# Altium schematic sheet KX1_DB.SchDoc
size 381 x 279 mm; PageSetup: Record=PageOptions|CenterHorizontal=True|CenterVertical=True|PrintScale=1.06|XCorrection=1.00|YCorrection=1.00|PrintKind=2|BorderSize=5000000|LeftOffset=0|BottomOffset=0|Orientation=2|PaperLength=1000|PaperWidth=1000|Scale=100|PaperSource=15|PrintQuality=600|MediaType=1|DitherType=10|PrintScaleMode=1|PaperKind=Letter
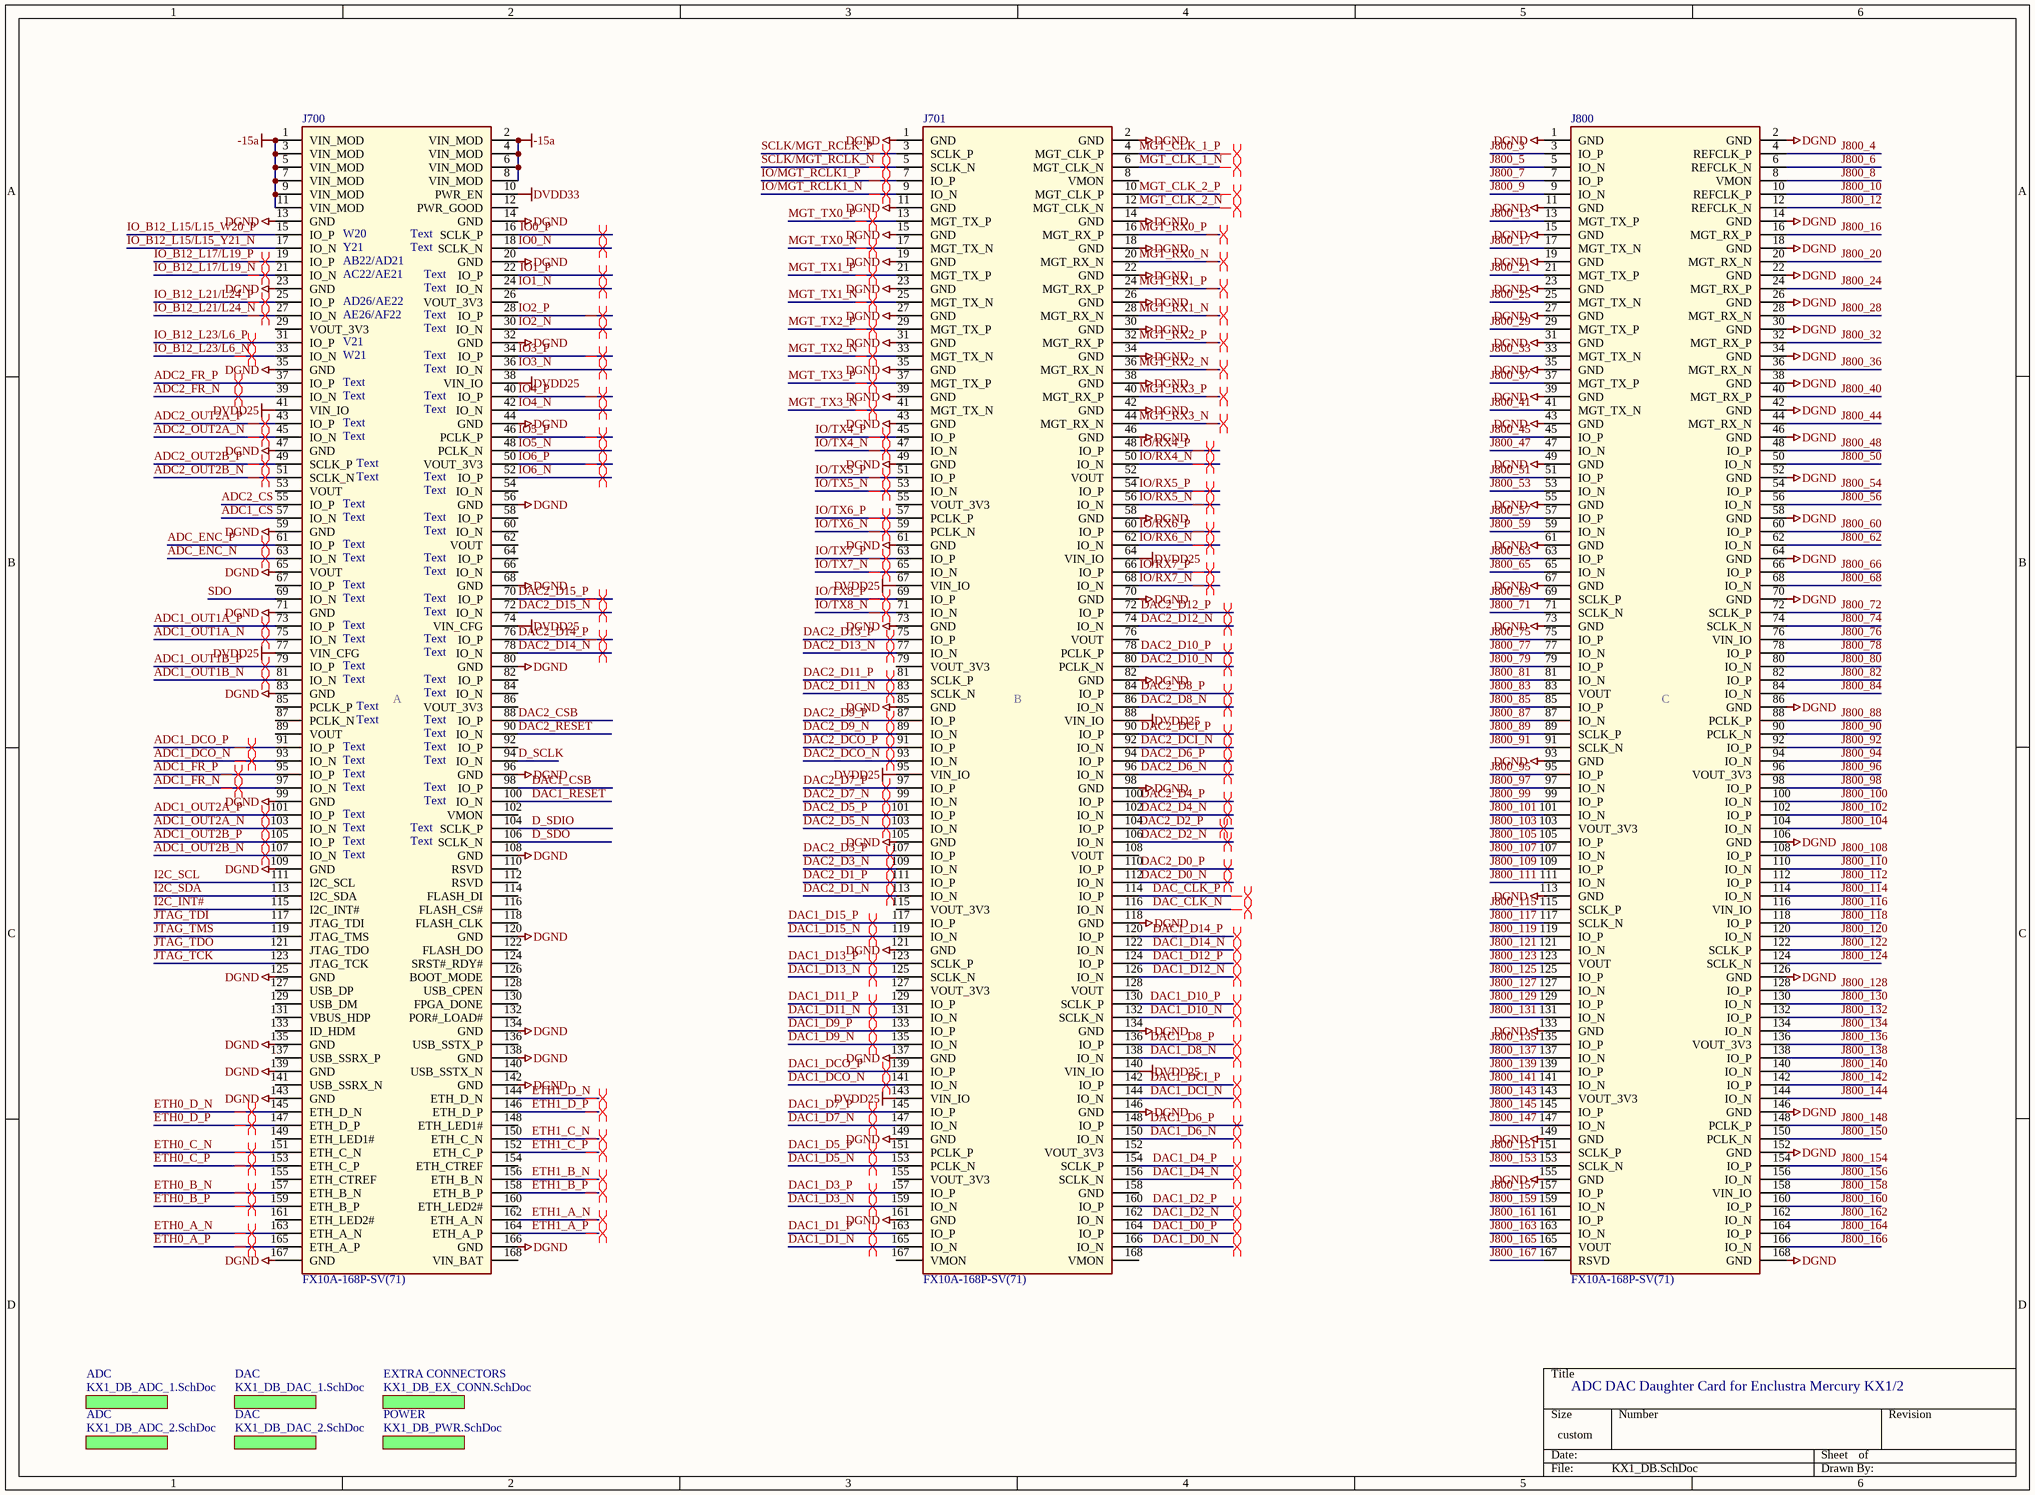
[diagram p0: KX1_DB.SchDoc]

## Parts
J700  FX10A-168P-SV(71)  [Mercury_Baseboard_Connector]
J701  FX10A-168P-SV(71)  [Mercury_Baseboard_Connector]
J800  FX10A-168P-SV(71)  [Mercury_Baseboard_Connector]

## Sub-sheets
ADC = KX1_DB_ADC_1.SchDoc: no entries
ADC = KX1_DB_ADC_2.SchDoc: no entries
DAC = KX1_DB_DAC_2.SchDoc: no entries
DAC = KX1_DB_DAC_1.SchDoc: no entries
EXTRA CONNECTORS = KX1_DB_EX_CONN.SchDoc: no entries
POWER = KX1_DB_PWR.SchDoc: no entries

## Nets
-15a: J700.1(VIN_MOD) J700.2(VIN_MOD) J700.3(VIN_MOD) J700.4(VIN_MOD) J700.5(VIN_MOD) J700.6(VIN_MOD) J700.7(VIN_MOD) J700.8(VIN_MOD) J700.9(VIN_MOD) J700.11(VIN_MOD)
DGND: J700.13(GND) J700.14(GND) J700.20(GND) J700.23(GND) J700.32(GND) J700.35(GND) J700.44(GND) J700.47(GND) J700.56(GND) J700.59(GND) J700.65(VOUT) J700.68(GND) J700.71(GND) J700.80(GND) J700.83(GND) J700.96(GND) J700.99(GND) J700.108(GND) J700.109(GND) J700.120(GND) J700.125(GND) J700.134(GND) J700.135(GND) J700.138(GND) J700.139(GND) J700.142(GND) J700.143(GND) J700.166(GND) J700.167(GND) J701.1(GND) J701.2(GND) J701.11(GND) J701.14(GND) J701.15(GND) J701.18(GND) J701.19(GND) J701.22(GND) J701.23(GND) J701.26(GND) J701.27(GND) J701.30(GND) J701.31(GND) J701.34(GND) J701.35(GND) J701.38(GND) J701.39(GND) J701.42(GND) J701.43(GND) J701.46(GND) J701.49(GND) J701.58(GND) J701.61(GND) J701.70(GND) J701.73(GND) J701.82(GND) J701.85(GND) J701.98(GND) J701.105(GND) J701.118(GND) J701.121(GND) J701.134(GND) J701.137(GND) J701.146(GND) J701.149(GND) J701.161(GND) J800.1(GND) J800.2(GND) J800.11(GND) J800.14(GND) J800.15(GND) J800.18(GND) J800.19(GND) J800.22(GND) J800.23(GND) J800.26(GND) J800.27(GND) J800.30(GND) J800.31(GND) J800.34(GND) J800.35(GND) J800.38(GND) J800.39(GND) J800.42(GND) J800.43(GND) J800.46(GND) J800.49(GND) J800.52(GND) J800.55(GND) J800.58(GND) J800.61(GND) J800.64(GND) J800.67(GND) J800.70(GND) J800.73(GND) J800.86(GND) J800.93(GND) J800.106(GND) J800.113(GND) J800.126(GND) J800.133(GND) J800.146(GND) J800.149(GND) J800.152(GND) J800.155(GND) J800.168(GND)
DVDD25: J700.38(VIN_IO) J700.41(VIN_IO) J700.74(VIN_CFG) J700.77(VIN_CFG) J701.64(VIN_IO) J701.67(VIN_IO) J701.88(VIN_IO) J701.95(VIN_IO) J701.140(VIN_IO) J701.143(VIN_IO)
DVDD33: J700.10(PWR_EN)
ADC1_CS: J700.57(IO_N)
ADC1_DCO_N: J700.93(IO_N)
ADC1_DCO_P: J700.91(IO_P)
ADC1_FR_N: J700.97(IO_N)
ADC1_FR_P: J700.95(IO_P)
ADC1_OUT1A_N: J700.75(IO_N)
ADC1_OUT1A_P: J700.73(IO_P)
ADC1_OUT1B_N: J700.81(IO_N)
ADC1_OUT1B_P: J700.79(IO_P)
ADC1_OUT2A_N: J700.103(IO_N)
ADC1_OUT2A_P: J700.101(IO_P)
ADC1_OUT2B_N: J700.107(IO_N)
ADC1_OUT2B_P: J700.105(IO_P)
ADC2_CS: J700.55(IO_P)
ADC2_FR_N: J700.39(IO_N)
ADC2_FR_P: J700.37(IO_P)
ADC2_OUT2A_N: J700.45(IO_N)
ADC2_OUT2A_P: J700.43(IO_P)
ADC2_OUT2B_N: J700.51(SCLK_N)
ADC2_OUT2B_P: J700.49(SCLK_P)
ADC_ENC_N: J700.63(IO_N)
ADC_ENC_P: J700.61(IO_P)
D_SCLK: J700.94(IO_N)
D_SDIO: J700.104(SCLK_P)
D_SDO: J700.106(SCLK_N)
DAC1_CSB: J700.98(IO_P)
DAC1_D0_N: J701.166(IO_N)
DAC1_D0_P: J701.164(IO_P)
DAC1_D1_N: J701.165(IO_N)
DAC1_D1_P: J701.163(IO_P)
DAC1_D2_N: J701.162(IO_N)
DAC1_D2_P: J701.160(IO_P)
DAC1_D3_N: J701.159(IO_N)
DAC1_D3_P: J701.157(IO_P)
DAC1_D4_N: J701.156(SCLK_N)
DAC1_D4_P: J701.154(SCLK_P)
DAC1_D5_N: J701.153(PCLK_N)
DAC1_D5_P: J701.151(PCLK_P)
DAC1_D6_N: J701.150(IO_N)
DAC1_D6_P: J701.148(IO_P)
DAC1_D7_N: J701.147(IO_N)
DAC1_D7_P: J701.145(IO_P)
DAC1_D8_N: J701.138(IO_N)
DAC1_D8_P: J701.136(IO_P)
DAC1_D9_N: J701.135(IO_N)
DAC1_D9_P: J701.133(IO_P)
DAC1_D10_N: J701.132(SCLK_N)
DAC1_D10_P: J701.130(SCLK_P)
DAC1_D11_N: J701.131(IO_N)
DAC1_D11_P: J701.129(IO_P)
DAC1_D12_N: J701.126(IO_N)
DAC1_D12_P: J701.124(IO_P)
DAC1_D13_N: J701.125(SCLK_N)
DAC1_D13_P: J701.123(SCLK_P)
DAC1_D14_N: J701.122(IO_N)
DAC1_D14_P: J701.120(IO_P)
DAC1_D15_N: J701.119(IO_N)
DAC1_D15_P: J701.117(IO_P)
DAC1_DCI_N: J701.144(IO_N)
DAC1_DCI_P: J701.142(IO_P)
DAC1_DCO_N: J701.141(IO_N)
DAC1_DCO_P: J701.139(IO_P)
DAC1_RESET: J700.100(IO_N)
DAC2_CSB: J700.88(IO_P)
DAC2_D0_N: J701.112(IO_N)
DAC2_D0_P: J701.110(IO_P)
DAC2_D1_N: J701.113(IO_N)
DAC2_D1_P: J701.111(IO_P)
DAC2_D2_N: J701.106(IO_N)
DAC2_D2_P: J701.104(IO_P)
DAC2_D3_N: J701.109(IO_N)
DAC2_D3_P: J701.107(IO_P)
DAC2_D4_N: J701.102(IO_N)
DAC2_D4_P: J701.100(IO_P)
DAC2_D5_N: J701.103(IO_N)
DAC2_D5_P: J701.101(IO_P)
DAC2_D6_N: J701.96(IO_N)
DAC2_D6_P: J701.94(IO_P)
DAC2_D7_N: J701.99(IO_N)
DAC2_D7_P: J701.97(IO_P)
DAC2_D8_N: J701.86(IO_N)
DAC2_D8_P: J701.84(IO_P)
DAC2_D9_N: J701.89(IO_N)
DAC2_D9_P: J701.87(IO_P)
DAC2_D10_N: J701.80(PCLK_N)
DAC2_D10_P: J701.78(PCLK_P)
DAC2_D11_N: J701.83(SCLK_N)
DAC2_D11_P: J701.81(SCLK_P)
DAC2_D12_N: J701.74(IO_N)
DAC2_D12_P: J701.72(IO_P)
DAC2_D13_N: J701.77(IO_N)
DAC2_D13_P: J701.75(IO_P)
DAC2_D14_N: J700.78(IO_N)
DAC2_D14_P: J700.76(IO_P)
DAC2_D15_N: J700.72(IO_N)
DAC2_D15_P: J700.70(IO_P)
DAC2_DCI_N: J701.92(IO_N)
DAC2_DCI_P: J701.90(IO_P)
DAC2_DCO_N: J701.93(IO_N)
DAC2_DCO_P: J701.91(IO_P)
DAC2_RESET: J700.90(IO_N)
DAC_CLK_N: J701.116(IO_N)
DAC_CLK_P: J701.114(IO_P)
ETH0_A_N: J700.163(ETH_A_N)
ETH0_A_P: J700.165(ETH_A_P)
ETH0_B_N: J700.157(ETH_B_N)
ETH0_B_P: J700.159(ETH_B_P)
ETH0_C_N: J700.151(ETH_C_N)
ETH0_C_P: J700.153(ETH_C_P)
ETH0_D_N: J700.145(ETH_D_N)
ETH0_D_P: J700.147(ETH_D_P)
ETH1_A_N: J700.162(ETH_A_N)
ETH1_A_P: J700.164(ETH_A_P)
ETH1_B_N: J700.156(ETH_B_N)
ETH1_B_P: J700.158(ETH_B_P)
ETH1_C_N: J700.150(ETH_C_N)
ETH1_C_P: J700.152(ETH_C_P)
ETH1_D_N: J700.144(ETH_D_N)
ETH1_D_P: J700.146(ETH_D_P)
I2C_INT#: J700.115(I2C_INT#)
I2C_SCL: J700.111(I2C_SCL)
I2C_SDA: J700.113(I2C_SDA)
IO0_N: J700.18(SCLK_N)
IO0_P: J700.16(SCLK_P)
IO1_N: J700.24(IO_N)
IO1_P: J700.22(IO_P)
IO2_N: J700.30(IO_N)
IO2_P: J700.28(IO_P)
IO3_N: J700.36(IO_N)
IO3_P: J700.34(IO_P)
IO4_N: J700.42(IO_N)
IO4_P: J700.40(IO_P)
IO5_N: J700.48(PCLK_N)
IO5_P: J700.46(PCLK_P)
IO6_N: J700.52(IO_P)
IO6_P: J700.50(VOUT_3V3)
IO/MGT_RCLK1_N: J701.9(IO_N)
IO/MGT_RCLK1_P: J701.7(IO_P)
IO/RX4_N: J701.50(IO_N)
IO/RX4_P: J701.48(IO_P)
IO/RX5_N: J701.56(IO_N)
IO/RX5_P: J701.54(IO_P)
IO/RX6_N: J701.62(IO_N)
IO/RX6_P: J701.60(IO_P)
IO/RX7_N: J701.68(IO_N)
IO/RX7_P: J701.66(IO_P)
IO/TX4_N: J701.47(IO_N)
IO/TX4_P: J701.45(IO_P)
IO/TX5_N: J701.53(IO_N)
IO/TX5_P: J701.51(IO_P)
IO/TX6_N: J701.59(PCLK_N)
IO/TX6_P: J701.57(PCLK_P)
IO/TX7_N: J701.65(IO_N)
IO/TX7_P: J701.63(IO_P)
IO/TX8_N: J701.71(IO_N)
IO/TX8_P: J701.69(IO_P)
IO_B12_L15/L15_W20_P: J700.15(IO_P)
IO_B12_L15/L15_Y21_N: J700.17(IO_N)
IO_B12_L17/L19_N: J700.21(IO_N)
IO_B12_L17/L19_P: J700.19(IO_P)
IO_B12_L21/L24_N: J700.27(IO_N)
IO_B12_L21/L24_P: J700.25(IO_P)
IO_B12_L23/L6_N: J700.33(IO_N)
IO_B12_L23/L6_P: J700.31(IO_P)
J800_3: J800.3(IO_P)
J800_4: J800.4(REFCLK_P)
J800_5: J800.5(IO_N)
J800_6: J800.6(REFCLK_N)
J800_7: J800.7(IO_P)
J800_8: J800.8(VMON)
J800_9: J800.9(IO_N)
J800_10: J800.10(REFCLK_P)
J800_12: J800.12(REFCLK_N)
J800_13: J800.13(MGT_TX_P)
J800_16: J800.16(MGT_RX_P)
J800_17: J800.17(MGT_TX_N)
J800_20: J800.20(MGT_RX_N)
J800_21: J800.21(MGT_TX_P)
J800_24: J800.24(MGT_RX_P)
J800_25: J800.25(MGT_TX_N)
J800_28: J800.28(MGT_RX_N)
J800_29: J800.29(MGT_TX_P)
J800_32: J800.32(MGT_RX_P)
J800_33: J800.33(MGT_TX_N)
J800_36: J800.36(MGT_RX_N)
J800_37: J800.37(MGT_TX_P)
J800_40: J800.40(MGT_RX_P)
J800_41: J800.41(MGT_TX_N)
J800_44: J800.44(MGT_RX_N)
J800_45: J800.45(IO_P)
J800_47: J800.47(IO_N)
J800_48: J800.48(IO_P)
J800_50: J800.50(IO_N)
J800_51: J800.51(IO_P)
J800_53: J800.53(IO_N)
J800_54: J800.54(IO_P)
J800_56: J800.56(IO_N)
J800_57: J800.57(IO_P)
J800_59: J800.59(IO_N)
J800_60: J800.60(IO_P)
J800_62: J800.62(IO_N)
J800_63: J800.63(IO_P)
J800_65: J800.65(IO_N)
J800_66: J800.66(IO_P)
J800_68: J800.68(IO_N)
J800_69: J800.69(SCLK_P)
J800_71: J800.71(SCLK_N)
J800_72: J800.72(SCLK_P)
J800_74: J800.74(SCLK_N)
J800_75: J800.75(IO_P)
J800_76: J800.76(VIN_IO)
J800_77: J800.77(IO_N)
J800_78: J800.78(IO_P)
J800_79: J800.79(IO_P)
J800_80: J800.80(IO_N)
J800_81: J800.81(IO_N)
J800_82: J800.82(IO_P)
J800_83: J800.83(VOUT)
J800_84: J800.84(IO_N)
J800_85: J800.85(IO_P)
J800_87: J800.87(IO_N)
J800_88: J800.88(PCLK_P)
J800_89: J800.89(SCLK_P)
J800_90: J800.90(PCLK_N)
J800_91: J800.91(SCLK_N)
J800_92: J800.92(IO_P)
J800_94: J800.94(IO_N)
J800_95: J800.95(IO_P)
J800_96: J800.96(VOUT_3V3)
J800_97: J800.97(IO_N)
J800_98: J800.98(IO_P)
J800_99: J800.99(IO_P)
J800_100: J800.100(IO_N)
J800_101: J800.101(IO_N)
J800_102: J800.102(IO_P)
J800_103: J800.103(VOUT_3V3)
J800_104: J800.104(IO_N)
J800_105: J800.105(IO_P)
J800_107: J800.107(IO_N)
J800_108: J800.108(IO_P)
J800_109: J800.109(IO_P)
J800_110: J800.110(IO_N)
J800_111: J800.111(IO_N)
J800_112: J800.112(IO_P)
J800_114: J800.114(IO_N)
J800_115: J800.115(SCLK_P)
J800_116: J800.116(VIN_IO)
J800_117: J800.117(SCLK_N)
J800_118: J800.118(IO_P)
J800_119: J800.119(IO_P)
J800_120: J800.120(IO_N)
J800_121: J800.121(IO_N)
J800_122: J800.122(SCLK_P)
J800_123: J800.123(VOUT)
J800_124: J800.124(SCLK_N)
J800_125: J800.125(IO_P)
J800_127: J800.127(IO_N)
J800_128: J800.128(IO_P)
J800_129: J800.129(IO_P)
J800_130: J800.130(IO_N)
J800_131: J800.131(IO_N)
J800_132: J800.132(IO_P)
J800_134: J800.134(IO_N)
J800_135: J800.135(IO_P)
J800_136: J800.136(VOUT_3V3)
J800_137: J800.137(IO_N)
J800_138: J800.138(IO_P)
J800_139: J800.139(IO_P)
J800_140: J800.140(IO_N)
J800_141: J800.141(IO_N)
J800_142: J800.142(IO_P)
J800_143: J800.143(VOUT_3V3)
J800_144: J800.144(IO_N)
J800_145: J800.145(IO_P)
J800_147: J800.147(IO_N)
J800_148: J800.148(PCLK_P)
J800_150: J800.150(PCLK_N)
J800_151: J800.151(SCLK_P)
J800_153: J800.153(SCLK_N)
J800_154: J800.154(IO_P)
J800_156: J800.156(IO_N)
J800_157: J800.157(IO_P)
J800_158: J800.158(VIN_IO)
J800_159: J800.159(IO_N)
J800_160: J800.160(IO_P)
J800_161: J800.161(IO_P)
J800_162: J800.162(IO_N)
J800_163: J800.163(IO_N)
J800_164: J800.164(IO_P)
J800_165: J800.165(VOUT)
J800_166: J800.166(IO_N)
J800_167: J800.167(RSVD)
JTAG_TCK: J700.123(JTAG_TCK)
JTAG_TDI: J700.117(JTAG_TDI)
JTAG_TDO: J700.121(JTAG_TDO)
JTAG_TMS: J700.119(JTAG_TMS)
MGT_CLK_1_N: J701.6(MGT_CLK_N)
MGT_CLK_1_P: J701.4(MGT_CLK_P)
MGT_CLK_2_N: J701.12(MGT_CLK_N)
MGT_CLK_2_P: J701.10(MGT_CLK_P)
MGT_RX0_N: J701.20(MGT_RX_N)
MGT_RX0_P: J701.16(MGT_RX_P)
MGT_RX1_N: J701.28(MGT_RX_N)
MGT_RX1_P: J701.24(MGT_RX_P)
MGT_RX2_N: J701.36(MGT_RX_N)
MGT_RX2_P: J701.32(MGT_RX_P)
MGT_RX3_N: J701.44(MGT_RX_N)
MGT_RX3_P: J701.40(MGT_RX_P)
MGT_TX0_N: J701.17(MGT_TX_N)
MGT_TX0_P: J701.13(MGT_TX_P)
MGT_TX1_N: J701.25(MGT_TX_N)
MGT_TX1_P: J701.21(MGT_TX_P)
MGT_TX2_N: J701.33(MGT_TX_N)
MGT_TX2_P: J701.29(MGT_TX_P)
MGT_TX3_N: J701.41(MGT_TX_N)
MGT_TX3_P: J701.37(MGT_TX_P)
SCLK/MGT_RCLK_N: J701.5(SCLK_N)
SCLK/MGT_RCLK_P: J701.3(SCLK_P)
SDO: J700.69(IO_N)

Not connected (* = marked no-connect by the designer): J700 12(PWR_GOOD) 26(VOUT_3V3) 29(VOUT_3V3) 53(VOUT) 54(IO_N) 58(IO_P) 60(IO_N) 62(VOUT) 64(IO_P) 66(IO_N) 67(IO_P) 82(IO_P) 84(IO_N) 85(PCLK_P) 86(VOUT_3V3) 87(PCLK_N) 89(VOUT) 92(IO_P) 102(VMON) 110(RSVD) 112(RSVD) 114(FLASH_DI) 116(FLASH_CS#) 118(FLASH_CLK) 122(FLASH_DO) 124(SRST#_RDY#) 126(BOOT_MODE) 127(USB_DP) 128(USB_CPEN) 129(USB_DM) 130(FPGA_DONE) 131(VBUS_HDP) 132(POR#_LOAD#) 133(ID_HDM) 136(USB_SSTX_P) 137(USB_SSRX_P) 140(USB_SSTX_N) 141(USB_SSRX_N) 148(ETH_LED1#) 149(ETH_LED1#) 154(ETH_CTREF) 155(ETH_CTREF) 160(ETH_LED2#) 161(ETH_LED2#) 168(VIN_BAT); J701 8(VMON) 52(VOUT) 55(VOUT_3V3) 76(VOUT) 79(VOUT_3V3) 108(VOUT) 115(VOUT_3V3) 127(VOUT_3V3) 128(VOUT) 152(VOUT_3V3) 155(VOUT_3V3) 158(GND) 167(VMON) 168(VMON)

## Layout directives
differential pair: ADC1_DCO_N, ADC1_DCO_P, ADC1_FR_N, ADC1_FR_P, ADC1_OUT1A_N, ADC1_OUT1A_P, ADC1_OUT1B_N, ADC1_OUT1B_P, ADC1_OUT2A_N, ADC1_OUT2A_P, ADC1_OUT2B_N, ADC1_OUT2B_P, ADC2_FR_N, ADC2_FR_P, ADC2_OUT2A_N, ADC2_OUT2A_P, ADC2_OUT2B_N, ADC2_OUT2B_P, ADC_ENC_N, ADC_ENC_P, DAC1_D0_N, DAC1_D0_P, DAC1_D1_N, DAC1_D1_P, DAC1_D2_N, DAC1_D2_P, DAC1_D3_N, DAC1_D3_P, DAC1_D4_N, DAC1_D4_P, DAC1_D5_N, DAC1_D5_P, DAC1_D6_N, DAC1_D6_P, DAC1_D7_N, DAC1_D7_P, DAC1_D8_N, DAC1_D8_P, DAC1_D9_N, DAC1_D9_P, DAC1_D10_N, DAC1_D10_P, DAC1_D11_N, DAC1_D11_P, DAC1_D12_N, DAC1_D12_P, DAC1_D13_N, DAC1_D13_P, DAC1_D14_N, DAC1_D14_P, DAC1_D15_N, DAC1_D15_P, DAC1_DCI_N, DAC1_DCI_P, DAC1_DCO_N, DAC1_DCO_P, DAC2_D0_N, DAC2_D0_P, DAC2_D1_N, DAC2_D1_P, DAC2_D2_N, DAC2_D2_P, DAC2_D3_N, DAC2_D3_P, DAC2_D4_N, DAC2_D4_P, DAC2_D5_N, DAC2_D5_P, DAC2_D6_N, DAC2_D6_P, DAC2_D7_N, DAC2_D7_P, DAC2_D8_N, DAC2_D8_P, DAC2_D9_N, DAC2_D9_P, DAC2_D10_N, DAC2_D10_P, DAC2_D11_N, DAC2_D11_P, DAC2_D12_N, DAC2_D12_P, DAC2_D13_N, DAC2_D13_P, DAC2_D14_N, DAC2_D14_P, DAC2_D15_N, DAC2_D15_P, DAC2_DCI_N, DAC2_DCI_P, DAC2_DCO_N, DAC2_DCO_P, DAC_CLK_N, DAC_CLK_P, ETH0_A_N, ETH0_A_P, ETH0_B_N, ETH0_B_P, ETH0_C_N, ETH0_C_P, ETH0_D_N, ETH0_D_P, ETH1_A_N, ETH1_A_P, ETH1_B_N, ETH1_B_P, ETH1_C_N, ETH1_C_P, ETH1_D_N, ETH1_D_P, IO0_N, IO0_P, IO1_N, IO1_P, IO2_N, IO2_P, IO3_N, IO3_P, IO4_N, IO4_P, IO5_N, IO5_P, IO6_N, IO6_P, IO/MGT_RCLK1_N, IO/MGT_RCLK1_P, IO/RX4_N, IO/RX4_P, IO/RX5_N, IO/RX5_P, IO/RX6_N, IO/RX6_P, IO/RX7_N, IO/RX7_P, IO/TX4_N, IO/TX4_P, IO/TX5_N, IO/TX5_P, IO/TX6_N, IO/TX6_P, IO/TX7_N, IO/TX7_P, IO/TX8_N, IO/TX8_P, IO_B12_L17/L19_N, IO_B12_L17/L19_P, IO_B12_L21/L24_N, IO_B12_L21/L24_P, IO_B12_L23/L6_N, IO_B12_L23/L6_P, MGT_CLK_1_N, MGT_CLK_1_P, MGT_CLK_2_N, MGT_CLK_2_P, MGT_RX0_N, MGT_RX0_P, MGT_RX1_N, MGT_RX1_P, MGT_RX2_N, MGT_RX2_P, MGT_RX3_N, MGT_RX3_P, MGT_TX0_N, MGT_TX0_P, MGT_TX1_N, MGT_TX1_P, MGT_TX2_N, MGT_TX2_P, MGT_TX3_N, MGT_TX3_P, SCLK/MGT_RCLK_N, SCLK/MGT_RCLK_P

## Notes on the sheet
- (near J700) W20
- (near J700) Y21
- (near J700) AB22/AD21
- (near J700) AC22/AE21
- (near J700) AD26/AE22
- (near J700) Text
- (near J700) AE26/AF22
- (near J700) V21
- (near J700) W21
- ADC DAC Daughter Card for Enclustra Mercury KX1/2
- (in symbol Mercury_Baseboard_Connector-A) A
- (in symbol Mercury_Baseboard_Connector-B) B
- (in symbol Mercury_Baseboard_Connector-C) C

## Library data of the parts
J700 = Mercury_Baseboard_Connector-A: Mercury Baseboard Connector; Manufacturer: Hirose; DistPartNumber: FX10A-168P-SV(71)-ND; Board_Variant: ALL; Check Sch: CG_2015-03-03; Enclustra PN: EN100374; Geometry.Height: 4mm stack height; Distributor: Digikey; Package: SMD - 168pin Hirose; ROHS: Yes; Supplier: Enclustra; Characteristics: -; Check PCB: -; Cost: 4.50; ManufPartNumber: FX10A-168P-SV(71); Temperature: -55..+85°C; Type: Connector; Value: FX10A-168P-SV(71)
J701 = Mercury_Baseboard_Connector-B: Mercury Baseboard Connector; Manufacturer: Hirose; DistPartNumber: FX10A-168P-SV(71)-ND; Board_Variant: ALL; Check Sch: CG_2015-03-03; Enclustra PN: EN100374; Geometry.Height: 4mm stack height; Distributor: Digikey; Package: SMD - 168pin Hirose; ROHS: Yes; Characteristics: -; Supplier: Enclustra; Check PCB: -; Cost: 4.50; ManufPartNumber: FX10A-168P-SV(71); Temperature: -55..+85°C; Type: Connector; Value: FX10A-168P-SV(71)
J800 = Mercury_Baseboard_Connector-C: Mercury Baseboard Connector; Manufacturer: Hirose; DistPartNumber: FX10A-168P-SV(71)-ND; Board_Variant: ALL; Check Sch: CG_2015-03-03; Enclustra PN: EN100374; Geometry.Height: 4mm stack height; Distributor: Digikey; Package: SMD - 168pin Hirose; ROHS: Yes; Characteristics: -; Supplier: Enclustra; Check PCB: -; Cost: 4.50; ManufPartNumber: FX10A-168P-SV(71); Temperature: -55..+85°C; Type: Connector; Value: FX10A-168P-SV(71)